# EAGLE schematic main_v1.0 (EAGLE 7.2.0)
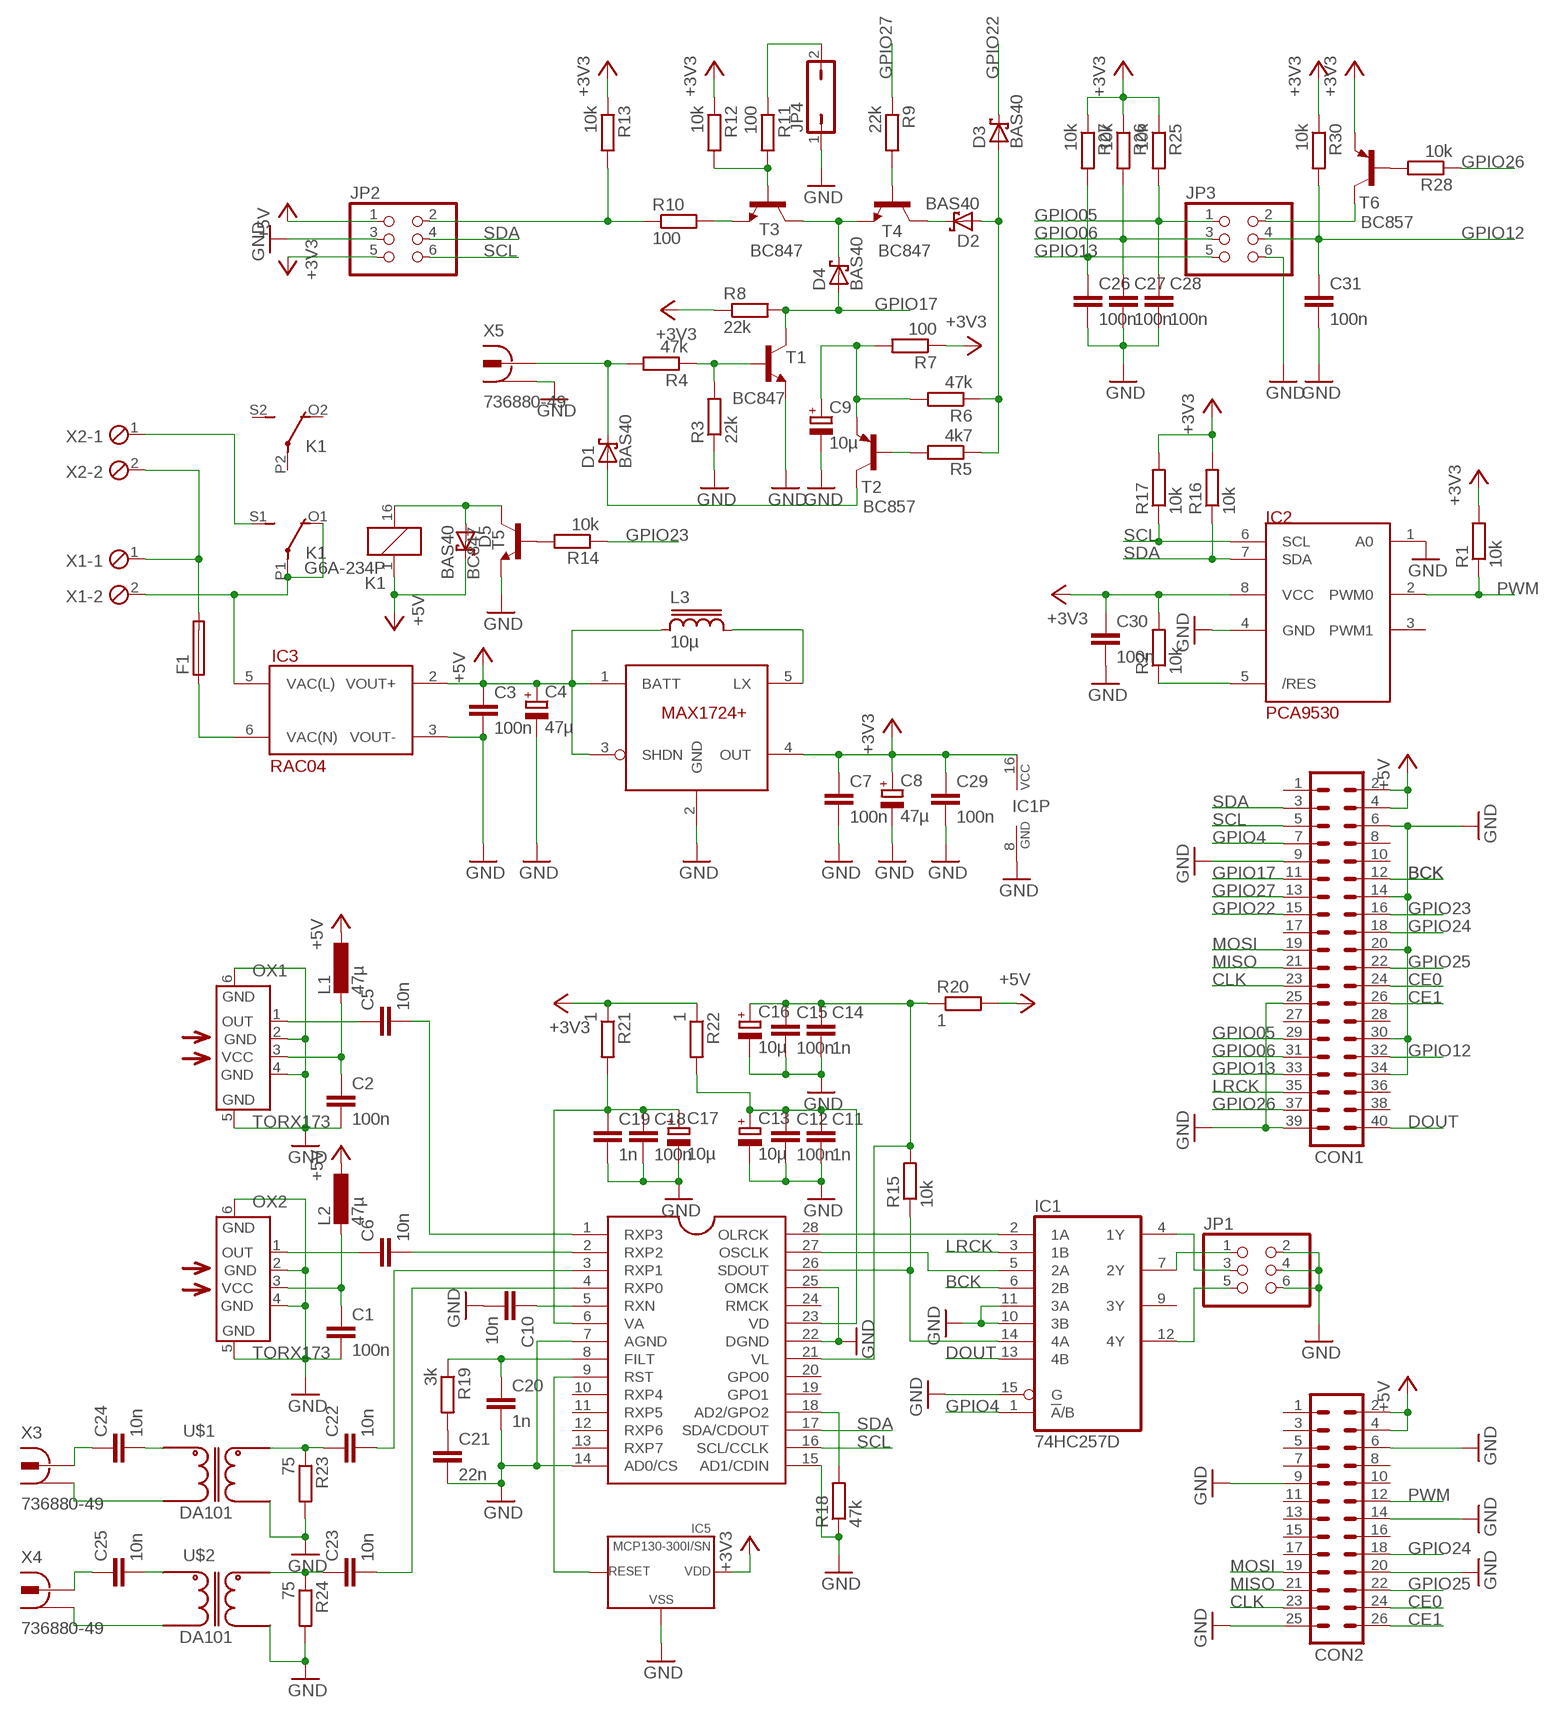
[diagram p0: schematic, sheet 1]

## Parts
C1  100n  C-EUC0805  [C0805]
C2  100n  C-EUC0805  [C0805]
C3  100n  C-EUC0805  [C0805]
C4  47µ  CPOL-EUCT3528  [CT3528]
C5  10n  C-EUC0805  [C0805]
C6  10n  C-EUC0805  [C0805]
C7  100n  C-EUC0805  [C0805]
C8  47µ  CPOL-EUCT3528  [CT3528]
C9  10µ  CPOL-EUCT3216  [CT3216]
C10  10n  C-EUC0805  [C0805]
C11  1n  C-EUC0805  [C0805]
C12  100n  C-EUC0805  [C0805]
C13  10µ  CPOL-EUCT3216  [CT3216]
C14  1n  C-EUC0805  [C0805]
C15  100n  C-EUC0805  [C0805]
C16  10µ  CPOL-EUCT3216  [CT3216]
C17  10µ  CPOL-EUCT3216  [CT3216]
C18  100n  C-EUC0805  [C0805]
C19  1n  C-EUC0805  [C0805]
C20  1n  C-EUC0805  [C0805]
C21  22n  C-EUC0805  [C0805]
C22  10n  C-EUC0805  [C0805]
C23  10n  C-EUC0805  [C0805]
C24  10n  C-EUC0805  [C0805]
C25  10n  C-EUC0805  [C0805]
C26  100n  C-EUC0805  [C0805]
C27  100n  C-EUC0805  [C0805]
C28  100n  C-EUC0805  [C0805]
C29  100n  C-EUC0805  [C0805]
C30  100n  C-EUC0805  [C0805]
C31  100n  C-EUC0805  [C0805]
CON1  MA20-2  [MA20-2]
CON2  MA13-2  [MA13-2]
D1  BAS40  [SOT23]
D2  BAS40  [SOT23]
D3  BAS40  [SOT23]
D4  BAS40  [SOT23]
D5  BAS40  [SOT23]
F1  19560  [19560]
IC1  74HC257D  [SO16]
IC2  PCA9530  [SOIC-8]
IC3  RAC04  [RECOM-RAC04]
IC4  CS8416  CS8416-SOFTWAREMODESOFTWAREMODE  [SO28L]
IC5  MCP130-300I/SN  [SOT-23]
IC6  MAX1724  [SOT23-5L]
JP1  PINHD-2X3  [2X03]
JP2  PINHD-2X3  [2X03]
JP3  PINHD-2X3  [2X03]
JP4  JP1Q  [JP1]
K1  G6A-234P  [G6A-234P]
L1  47µ  L-EU  [C1210]
L2  47µ  L-EU  [C1210]
L3  10µ  DS1608C  [DS1608]
OX1  TORX173  [TORX173]
OX2  TORX173  [TORX173]
R1  10k  R-EU_R0805  [R0805]
R2  10k  R-EU_R0805  [R0805]
R3  22k  R-EU_R0805  [R0805]
R4  47k  R-EU_R0805  [R0805]
R5  4k7  R-EU_R0805  [R0805]
R6  47k  R-EU_R0805  [R0805]
R7  100  R-EU_R0805  [R0805]
R8  22k  R-EU_R0805  [R0805]
R9  22k  R-EU_R0805  [R0805]
R10  100  R-EU_R0805  [R0805]
R11  100  R-EU_R0805  [R0805]
R12  10k  R-EU_R0805  [R0805]
R13  10k  R-EU_R0805  [R0805]
R14  10k  R-EU_R0805  [R0805]
R15  10k  R-EU_R0805  [R0805]
R16  10k  R-EU_R0805  [R0805]
R17  10k  R-EU_R0805  [R0805]
R18  47k  R-EU_R0805  [R0805]
R19  3k  R-EU_R0805  [R0805]
R20  1  R-EU_R0805  [R0805]
R21  1  R-EU_R0805  [R0805]
R22  1  R-EU_R0805  [R0805]
R23  75  R-EU_R0805  [R0805]
R24  75  R-EU_R0805  [R0805]
R25  10k  R-EU_R0805  [R0805]
R26  10k  R-EU_R0805  [R0805]
R27  10k  R-EU_R0805  [R0805]
R28  10k  R-EU_R0805  [R0805]
R30  10k  R-EU_R0805  [R0805]
T1  BC847  BC847-NPN-SOT23-BEC  [SOT23-BEC]
T2  BC857  BC857A-PNP-SOT23-BEC  [SOT23-BEC]
T3  BC847  BC847-NPN-SOT23-BEC  [SOT23-BEC]
T4  BC847  BC847-NPN-SOT23-BEC  [SOT23-BEC]
T5  BC847  BC847-NPN-SOT23-BEC  [SOT23-BEC]
T6  BC857  BC857A-PNP-SOT23-BEC  [SOT23-BEC]
U$1  DA101  [6PIN-DIL]
U$2  DA101  [6PIN-DIL]
X1  2POL500  [2POL500]
X2  2POL500  [2POL500]
X3  736880-49  [736880-49]
X4  736880-49  [736880-49]
X5  736880-49  [736880-49]

## Nets
+3V3: C7.1 C8.+ C29.1 C30.1 IC1.16(VCC) IC2.8(VCC) IC5.2(VDD) IC6.4(OUT) JP2.5 R1.2 R2.2 R7.1 R8.1 R12.1 R13.1 R16.2 R17.2 R21.1 R22.1 R25.1 R26.1 R27.1 R30.1 T6.E
+5V: C3.1 C4.+ CON1.2 CON1.4 CON2.2 CON2.4 D5.3(C) IC3.2(VOUT+) IC6.1(BATT) IC6.3(SHDN) JP2.1 K1.1 L1.1 L2.1 L3.1 R20.2
BCK: CON1.12 IC1.6(2B)
CE0: CON1.24 CON2.24
CE1: CON1.26 CON2.26
CLK: CON1.23 CON2.23
DOUT: CON1.40 IC1.13(4B)
GND: C1.2 C2.2 C3.2 C4.- C7.2 C8.- C9.- C10.2 C11.2 C12.2 C13.- C14.2 C15.2 C16.- C17.- C18.2 C19.2 C20.2 C21.2 C26.2 C27.2 C28.2 C29.2 C30.2 C31.2 CON1.6 CON1.9 CON1.14 CON1.20 CON1.25 CON1.30 CON1.34 CON1.39 CON2.6 CON2.9 CON2.14 CON2.20 CON2.25 IC1.8(GND) IC1.10(3B) IC1.11(3A) IC1.15(G) IC2.1(A0) IC2.4(GND) IC3.3(VOUT-) IC4.7(AGND) IC4.14(AD0/CS) IC4.15(AD1/CDIN) IC4.22(DGND) IC4.25(OMCK) IC5.3(VSS) JP1.2 JP1.4 JP1.6 JP2.3 JP3.6 JP4.1 OX1.2(GND) OX1.4(GND) OX1.5(GND) OX1.6(GND) OX2.2(GND) OX2.4(GND) OX2.5(GND) OX2.6(GND) R3.1 R18.1 R23.2 R24.2 T1.E T5.E U$1.4 U$2.4 X5.1 X5.1@1 X5.1@2
GPIO4: CON1.7 IC1.1(!A!/B)
GPIO05: C28.1 CON1.29 JP3.1 R25.2
GPIO06: C27.1 CON1.31 JP3.3 R26.2
GPIO12: C31.1 CON1.32 JP3.4 R30.2
GPIO13: C26.1 CON1.33 JP3.5 R27.2
GPIO17: CON1.11 D4.1(A) R8.2 T1.C
GPIO22: CON1.15 D3.3(C)
GPIO23: CON1.16 R14.1
GPIO24: CON1.18 CON2.18
GPIO25: CON1.22 CON2.22
GPIO26: CON1.37 R28.1
GPIO27: CON1.13 R9.1
LRCK: CON1.35 IC1.3(1B)
MISO: CON1.21 CON2.21
MOSI: CON1.19 CON2.19
N$1: C11.1 C12.1 C13.+ IC4.23(VD) R22.2
N$2: IC1.2(1A) IC4.28(OLRCK)
N$3: IC1.5(2A) IC4.27(OSCLK)
N$4: IC1.14(4A) IC4.26(SDOUT) R15.1
N$5: IC4.9(RST) IC5.1(RESET)
N$6: IC2.5(/RES) R2.1
N$7: F1.1 IC3.6(VAC(N))
N$8: C17.+ C18.1 C19.1 IC4.6(VA) R21.2
N$9: C6.1 OX2.1(OUT)
N$10: C5.1 OX1.1(OUT)
N$11: C6.2 IC4.2(RXP2)
N$12: C5.2 IC4.1(RXP3)
N$13: IC3.5(VAC(L)) K1.O1(2:O) K1.P1(2:P) X1.2
N$14: R3.2 R4.1 T1.B
N$15: JP4.2 R11.1
N$16: D1.1(A) T2.C
N$17: D1.3(C) R4.2 X5.2
N$18: C9.+ R6.2 R7.2 T2.E
N$19: R5.2 T2.B
N$20: D2.1(A) D3.1(A) R5.1 R6.1
N$21: D4.3(C) T3.C T4.E
N$22: R10.2 T3.E
N$23: R11.2 R12.2 T3.B
N$24: R9.2 T4.B
N$25: D2.3(C) T4.C
N$26: IC1.7(2Y) JP1.1
N$27: IC1.4(1Y) JP1.3
N$28: IC6.5(LX) L3.2
N$29: JP2.2 R10.1 R13.2
N$30: C10.1 IC4.5(RXN)
N$31: IC4.18(AD2/GPO2) R18.2
N$32: C14.1 C15.1 C16.+ IC4.21(VL) R15.2 R20.1
N$33: D5.1(A) K1.16 T5.C
N$34: R14.2 T5.B
N$35: C22.1 R23.1 U$1.6
N$36: C20.1 IC4.8(FILT) R19.1
N$37: C21.1 R19.2
N$38: C22.2 IC4.3(RXP1)
N$39: C23.2 IC4.4(RXP0)
N$40: C23.1 R24.1 U$2.6
N$41: C24.2 U$1.1
N$42: U$1.3 X3.1 X3.1@1 X3.1@2
N$43: C24.1 X3.2
N$44: C25.2 U$2.1
N$45: U$2.3 X4.1 X4.1@1 X4.1@2
N$46: C25.1 X4.2
N$47: R28.2 T6.B
N$48: K1.S1(2:S) X2.1
N$49: F1.2 X1.1 X2.2
N$50: C2.1 L1.2 OX1.3(VCC)
N$51: C1.1 L2.2 OX2.3(VCC)
N$53: IC1.12(4Y) JP1.5
N$54: JP3.2 T6.C
PWM: CON2.12 IC2.2(PWM0) R1.1
SCL: CON1.5 IC2.6(SCL) IC4.16(SCL/CCLK) JP2.6 R17.1
SDA: CON1.3 IC2.7(SDA) IC4.17(SDA/CDOUT) JP2.4 R16.1
Unconnected: CON1.1 CON1.8 CON1.10 CON1.17 CON1.27 CON1.28 CON1.36 CON1.38 CON2.1 CON2.3 CON2.5 CON2.7 CON2.8 CON2.10 CON2.11 CON2.13 CON2.15 CON2.16 CON2.17 IC1.9(3Y) IC2.3(PWM1) IC4.10(RXP4) IC4.11(RXP5) IC4.12(RXP6) IC4.13(RXP7) IC4.19(GPO1) IC4.20(GPO0) IC4.24(RMCK) IC6.2(GND) K1.O2(3:O) K1.P2(3:P) K1.S2(3:S)

## Library data of the parts
C1-C3 C5-C7 C10-C12 C14 C15 C18-C31 = rcl:C-EU: CAPACITOR, European symbol
C4 C8 C9 C13 C16 C17 = rcl:CPOL-EU: POLARIZED CAPACITOR, European symbol
CON1 = con-lstb:MA20-2: PIN HEADER; OC_FARNELL: unknown; OC_NEWARK: unknown
CON2 = con-lstb:MA13-2: PIN HEADER; OC_FARNELL: unknown; OC_NEWARK: unknown
D1-D5 = diode:BAS40: Silicon Schottky Diodes General-purpose diode for high-speed switching
F1 = fuse:19560: FUSE HOLDER TR5, Wickmann; MPN: 56000001009; OC_FARNELL: 1185363; OC_NEWARK: 15P8392
IC1 = 74xx-eu:74*257: Quadruple 2-to 1 line data SELECTOR/MULTIPLEXER
IC2 = user:PCA9530
IC3 = user:RAC04
IC4 = cirrus-dar:CS8416-SOFTWAREMODE: 24bit 192kHz Digital Audio Interface Receiver - Software Mode
IC5 = microchip_mcp130:MCP130
IC6 = MAX1724:MAX1724
JP1-JP3 = pinhead:PINHD-2X3: PIN HEADER
JP4 = jumper:JP1Q: JUMPER
K1 = relay:G6A-234P: RELAY 2 x switch, 0.3 A/125 V AC, 1 A/30 V DC, Omron; OC_FARNELL: unknown; OC_NEWARK: unknown
L1 L2 = user:L-EU: INDUCTOR, European symbol
L3 = inductor-coilcraft:DS1608: SMT Power Inductor
OX1 OX2 = toshiba:TORX173: FIBER OPTIC RECEIVING MODULE FOR DIGITAL AUDIO EQUIPMENT, TTL Interface TORX173.pdf; OC_FARNELL: unknown; OC_NEWARK: unknown
R1-R28 R30 = rcl:R-EU_: RESISTOR, European symbol
T1 T3-T5 = transistor:*-NPN-: NPN Transistror BF959 corrected 2008.03.06
T2 T6 = transistor:*-PNP-: PNP Transistror
U$1 U$2 = user:DA101
X1 X2 = user:2POL500: PHOENIX CONNECTOR; OC_FARNELL: unknown; OC_NEWARK: unknown
X3-X5 = con-conrad:736880-49: Cinch Connector ( RCA Jack ) Cinch-Einbaukupplung 90º 72345 Vernickelt BKL Electronic Source: Conrad <http://www.conrad.de/ce/de/product/736880>